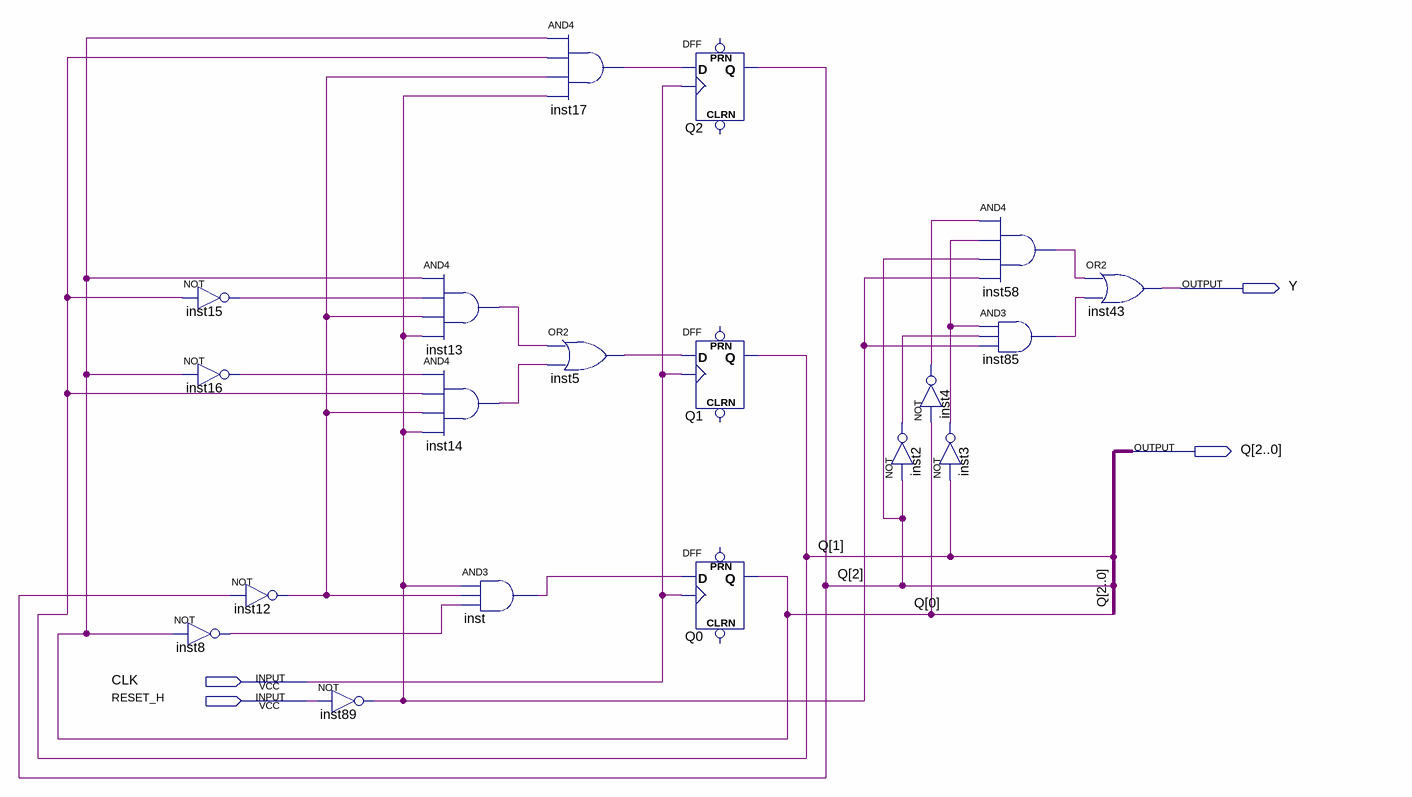
[diagram p0: schematic sheet]
// Quartus schematic exer1.bdf as structural Verilog: 19 symbols, 4 pins
module exer1 (
  input  CLK,
  input  RESET_H,
  output Y,
  output [2:0] Q
);

  wire inst2_out, inst3_out, inst4_out, inst5_out, inst8_out, inst12_out, inst13_out, inst14_out, inst15_out,
       inst16_out, inst17_out, inst58_out, inst85_out, inst89_out, inst_out;

  not inst15 (inst15_out, Q[1]);
  not inst16 (inst16_out, Q[0]);
  not inst8 (inst8_out, Q[0]);
  not inst12 (inst12_out, Q[2]);
  not inst89 (inst89_out, RESET_H);
  and inst13 (inst13_out, Q[0], inst15_out, inst12_out, inst89_out);
  and inst14 (inst14_out, inst16_out, Q[1], inst12_out, inst89_out);
  and inst (inst_out, inst89_out, inst12_out, inst8_out);
  and inst17 (inst17_out, Q[0], Q[1], inst12_out, inst89_out);
  or inst5 (inst5_out, inst13_out, inst14_out);
  DFF Q2 (.CLK(CLK), .D(inst17_out), .Q(Q[2]));  // open: CLRN, PRN
  DFF Q1 (.CLK(CLK), .D(inst5_out), .Q(Q[1]));  // open: CLRN, PRN
  DFF Q0 (.CLK(CLK), .D(inst_out), .Q(Q[0]));  // open: CLRN, PRN
  not inst4 (inst4_out, Q[0]);
  not inst2 (inst2_out, Q[2]);
  and inst58 (inst58_out, inst4_out, inst3_out, Q[2], inst89_out);
  and inst85 (inst85_out, inst3_out, inst2_out, inst89_out);
  not inst3 (inst3_out, Q[1]);
  or inst43 (Y, inst58_out, inst85_out);
endmodule
